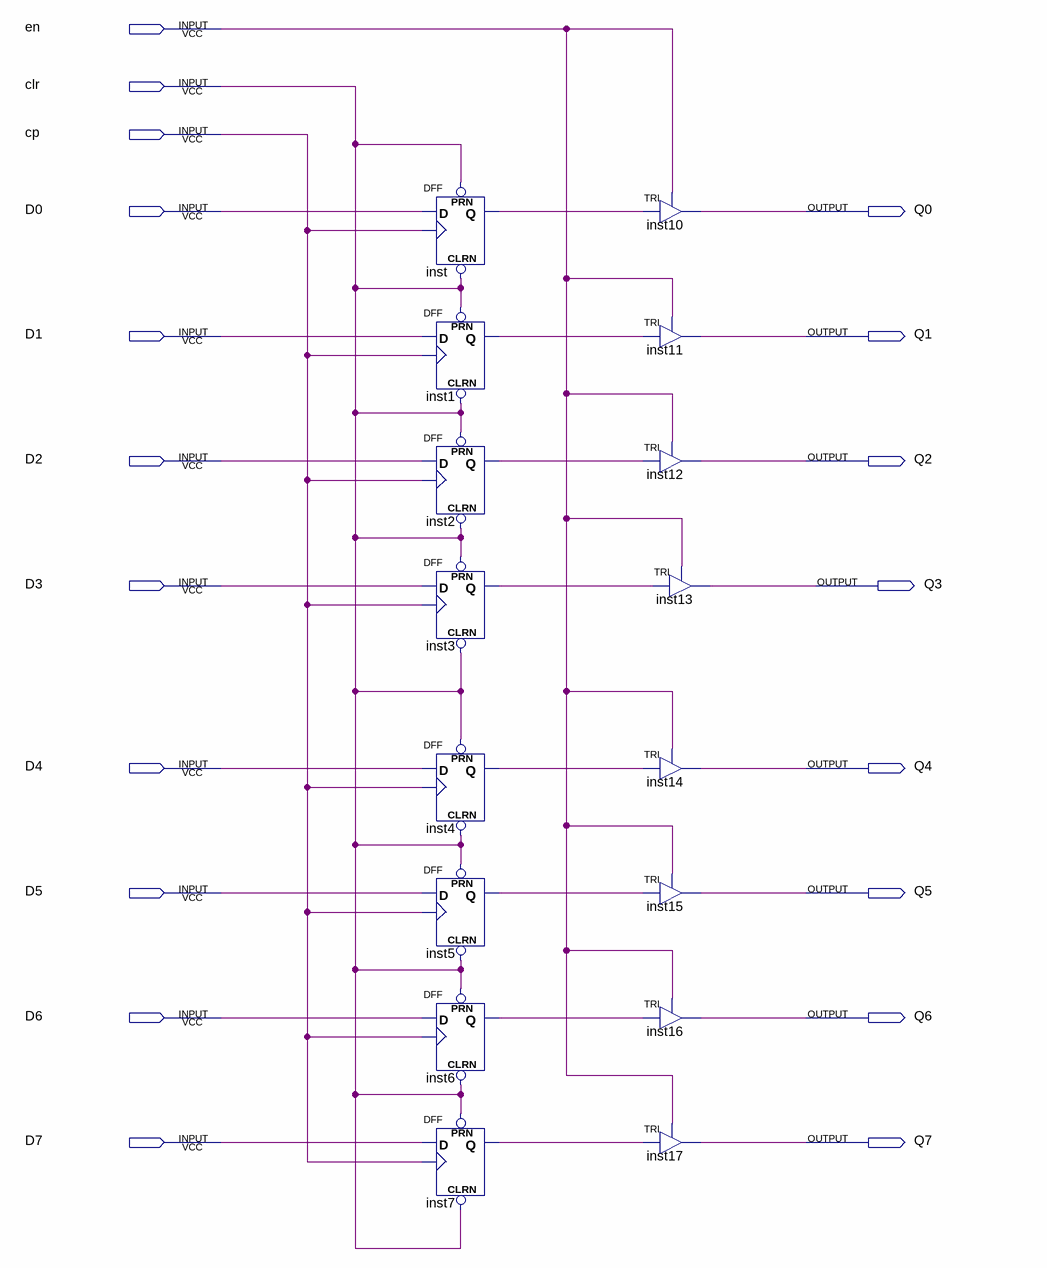
[diagram p0: schematic sheet]
// Quartus schematic hr-register-8.bdf as structural Verilog: 16 symbols, 19 pins
module \hr-register-8  (
  input  en,
  input  clr,
  input  cp,
  input  D0,
  input  D1,
  input  D2,
  input  D3,
  input  D4,
  input  D5,
  input  D6,
  input  D7,
  output Q0,
  output Q1,
  output Q2,
  output Q3,
  output Q4,
  output Q5,
  output Q6,
  output Q7
);

  wire inst1_q, inst2_q, inst3_q, inst4_q, inst5_q, inst6_q, inst7_q, inst_q;

  DFF inst (.CLRN(clr), .CLK(cp), .D(D0), .PRN(clr), .Q(inst_q));
  DFF inst1 (.CLRN(clr), .CLK(cp), .D(D1), .PRN(clr), .Q(inst1_q));
  DFF inst2 (.CLRN(clr), .CLK(cp), .D(D2), .PRN(clr), .Q(inst2_q));
  DFF inst3 (.CLRN(clr), .CLK(cp), .D(D3), .PRN(clr), .Q(inst3_q));
  DFF inst4 (.CLRN(clr), .CLK(cp), .D(D4), .PRN(clr), .Q(inst4_q));
  DFF inst5 (.CLRN(clr), .CLK(cp), .D(D5), .PRN(clr), .Q(inst5_q));
  DFF inst6 (.CLRN(clr), .CLK(cp), .D(D6), .PRN(clr), .Q(inst6_q));
  DFF inst7 (.CLRN(clr), .CLK(cp), .D(D7), .PRN(clr), .Q(inst7_q));
  TRI inst10 (.IN(inst_q), .OE(en), .OUT(Q0));
  TRI inst11 (.IN(inst1_q), .OE(en), .OUT(Q1));
  TRI inst12 (.IN(inst2_q), .OE(en), .OUT(Q2));
  TRI inst13 (.IN(inst3_q), .OE(en), .OUT(Q3));
  TRI inst14 (.IN(inst4_q), .OE(en), .OUT(Q4));
  TRI inst15 (.IN(inst5_q), .OE(en), .OUT(Q5));
  TRI inst16 (.IN(inst6_q), .OE(en), .OUT(Q6));
  TRI inst17 (.IN(inst7_q), .OE(en), .OUT(Q7));
endmodule
